# EAGLE schematic main (EAGLE 7.4.0)
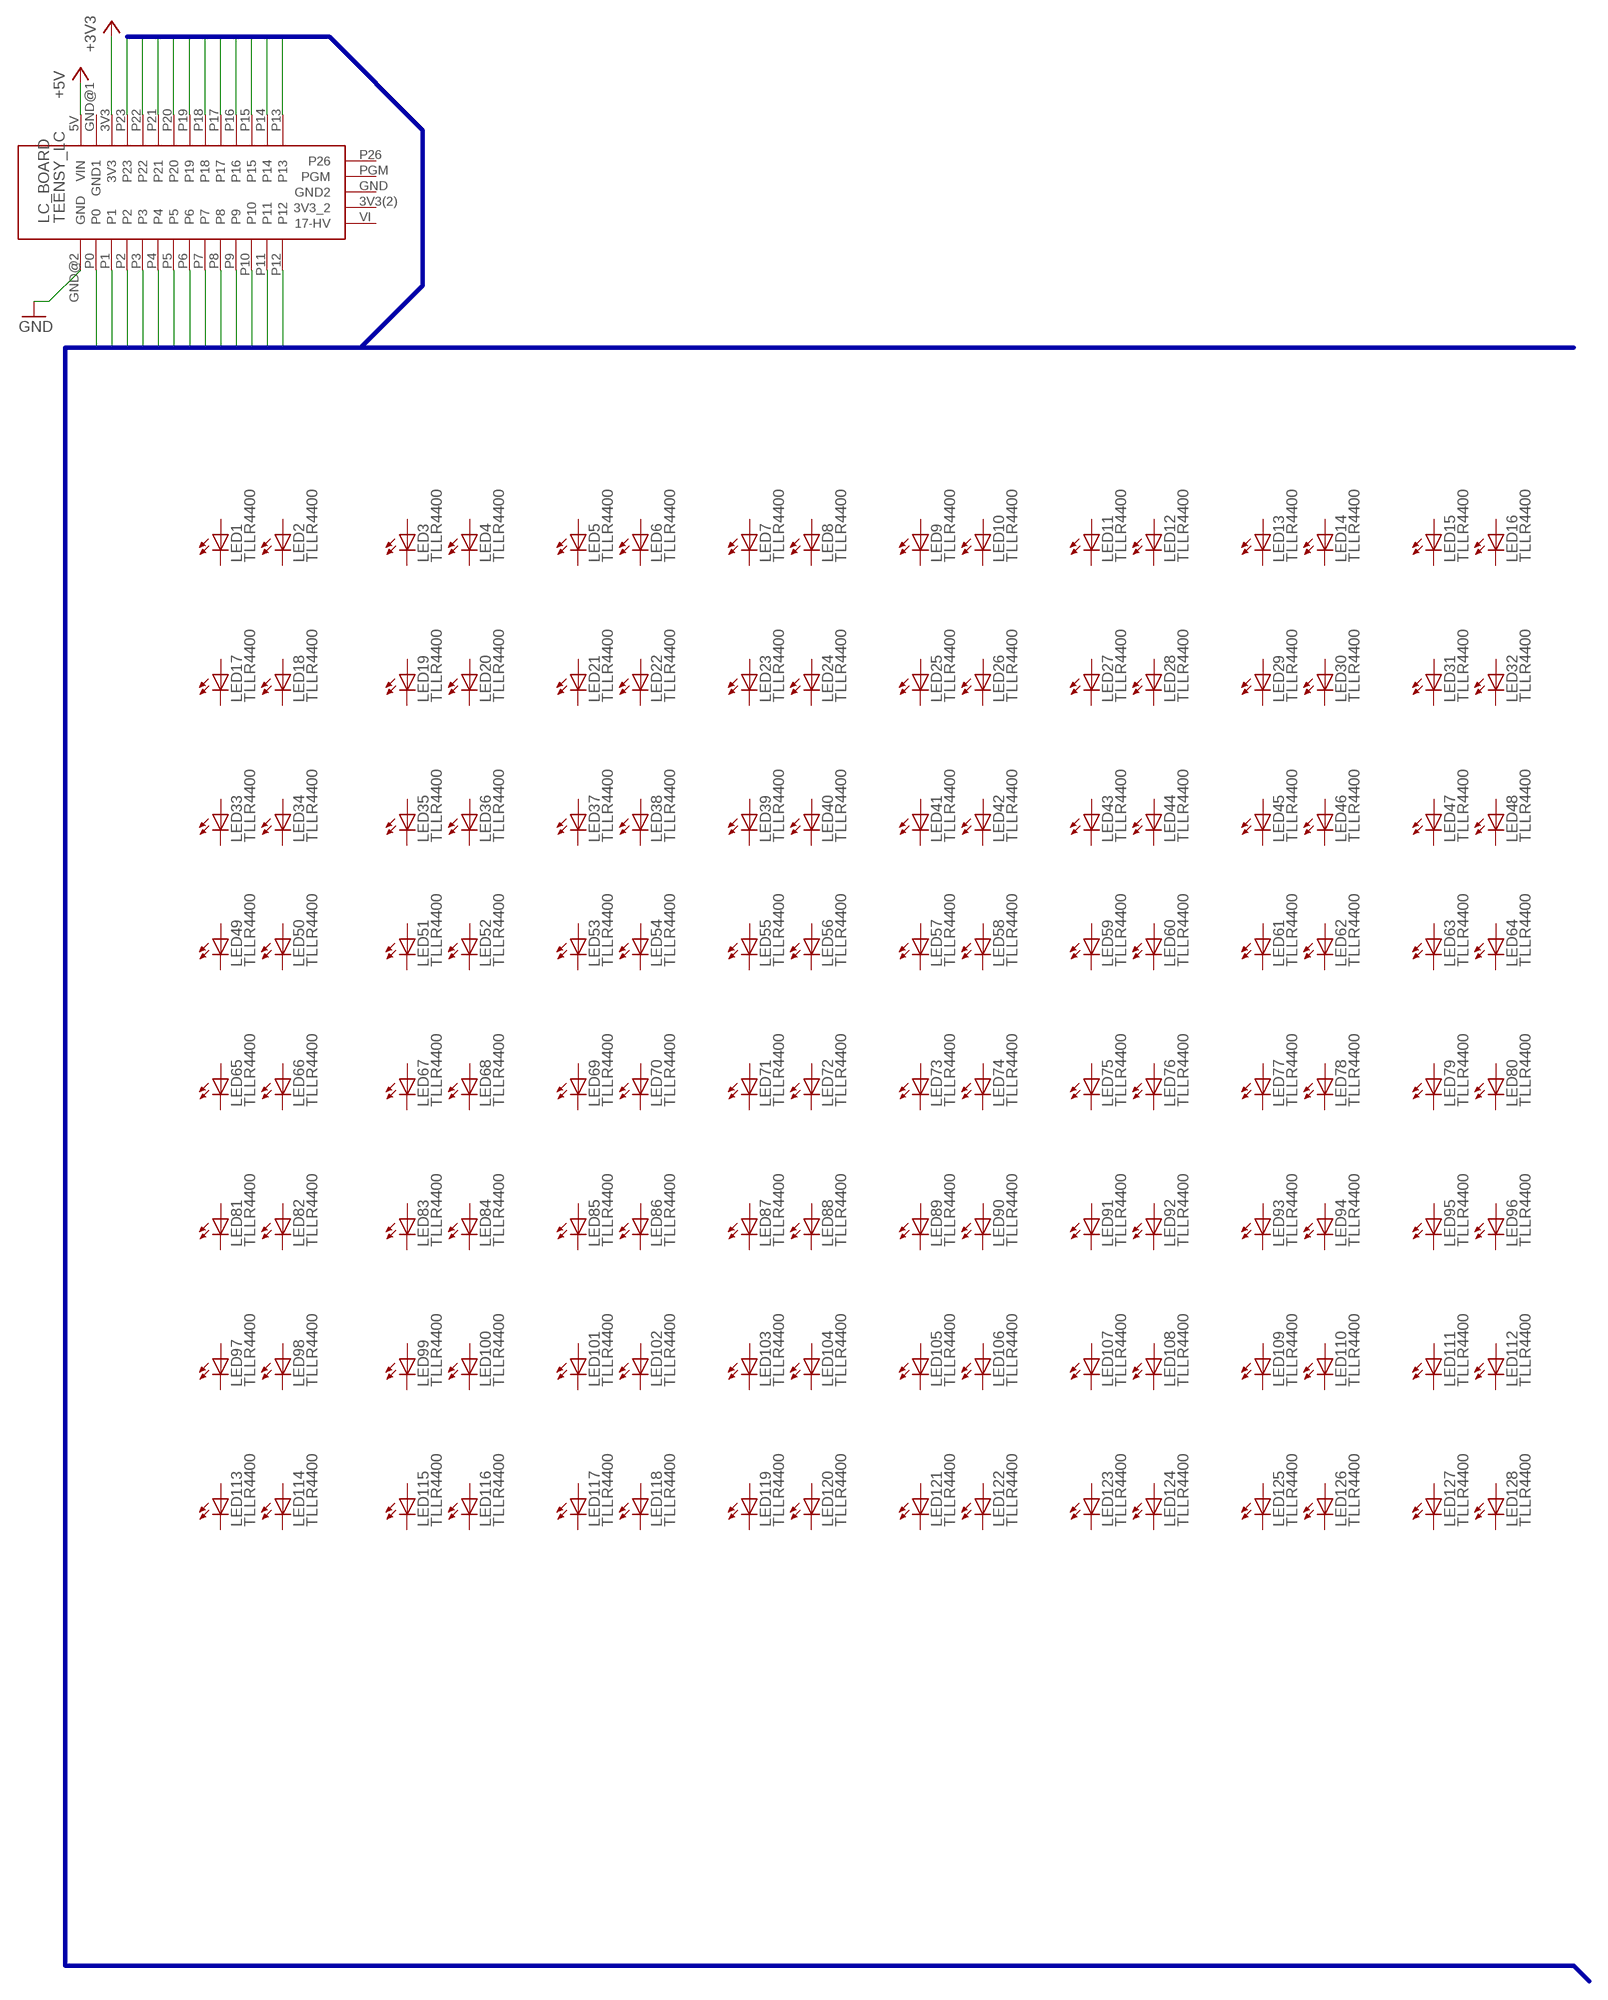
[diagram p0: schematic, sheet 1]

## Parts
LC_BOARD  TEENSY_LC  [TEENSYLC_PAC]
LED1  TLLR4400  [LED3MM]
LED2  TLLR4400  [LED3MM]
LED3  TLLR4400  [LED3MM]
LED4  TLLR4400  [LED3MM]
LED5  TLLR4400  [LED3MM]
LED6  TLLR4400  [LED3MM]
LED7  TLLR4400  [LED3MM]
LED8  TLLR4400  [LED3MM]
LED9  TLLR4400  [LED3MM]
LED10  TLLR4400  [LED3MM]
LED11  TLLR4400  [LED3MM]
LED12  TLLR4400  [LED3MM]
LED13  TLLR4400  [LED3MM]
LED14  TLLR4400  [LED3MM]
LED15  TLLR4400  [LED3MM]
LED16  TLLR4400  [LED3MM]
LED17  TLLR4400  [LED3MM]
LED18  TLLR4400  [LED3MM]
LED19  TLLR4400  [LED3MM]
LED20  TLLR4400  [LED3MM]
LED21  TLLR4400  [LED3MM]
LED22  TLLR4400  [LED3MM]
LED23  TLLR4400  [LED3MM]
LED24  TLLR4400  [LED3MM]
LED25  TLLR4400  [LED3MM]
LED26  TLLR4400  [LED3MM]
LED27  TLLR4400  [LED3MM]
LED28  TLLR4400  [LED3MM]
LED29  TLLR4400  [LED3MM]
LED30  TLLR4400  [LED3MM]
LED31  TLLR4400  [LED3MM]
LED32  TLLR4400  [LED3MM]
LED33  TLLR4400  [LED3MM]
LED34  TLLR4400  [LED3MM]
LED35  TLLR4400  [LED3MM]
LED36  TLLR4400  [LED3MM]
LED37  TLLR4400  [LED3MM]
LED38  TLLR4400  [LED3MM]
LED39  TLLR4400  [LED3MM]
LED40  TLLR4400  [LED3MM]
LED41  TLLR4400  [LED3MM]
LED42  TLLR4400  [LED3MM]
LED43  TLLR4400  [LED3MM]
LED44  TLLR4400  [LED3MM]
LED45  TLLR4400  [LED3MM]
LED46  TLLR4400  [LED3MM]
LED47  TLLR4400  [LED3MM]
LED48  TLLR4400  [LED3MM]
LED49  TLLR4400  [LED3MM]
LED50  TLLR4400  [LED3MM]
LED51  TLLR4400  [LED3MM]
LED52  TLLR4400  [LED3MM]
LED53  TLLR4400  [LED3MM]
LED54  TLLR4400  [LED3MM]
LED55  TLLR4400  [LED3MM]
LED56  TLLR4400  [LED3MM]
LED57  TLLR4400  [LED3MM]
LED58  TLLR4400  [LED3MM]
LED59  TLLR4400  [LED3MM]
LED60  TLLR4400  [LED3MM]
LED61  TLLR4400  [LED3MM]
LED62  TLLR4400  [LED3MM]
LED63  TLLR4400  [LED3MM]
LED64  TLLR4400  [LED3MM]
LED65  TLLR4400  [LED3MM]
LED66  TLLR4400  [LED3MM]
LED67  TLLR4400  [LED3MM]
LED68  TLLR4400  [LED3MM]
LED69  TLLR4400  [LED3MM]
LED70  TLLR4400  [LED3MM]
LED71  TLLR4400  [LED3MM]
LED72  TLLR4400  [LED3MM]
LED73  TLLR4400  [LED3MM]
LED74  TLLR4400  [LED3MM]
LED75  TLLR4400  [LED3MM]
LED76  TLLR4400  [LED3MM]
LED77  TLLR4400  [LED3MM]
LED78  TLLR4400  [LED3MM]
LED79  TLLR4400  [LED3MM]
LED80  TLLR4400  [LED3MM]
LED81  TLLR4400  [LED3MM]
LED82  TLLR4400  [LED3MM]
LED83  TLLR4400  [LED3MM]
LED84  TLLR4400  [LED3MM]
LED85  TLLR4400  [LED3MM]
LED86  TLLR4400  [LED3MM]
LED87  TLLR4400  [LED3MM]
LED88  TLLR4400  [LED3MM]
LED89  TLLR4400  [LED3MM]
LED90  TLLR4400  [LED3MM]
LED91  TLLR4400  [LED3MM]
LED92  TLLR4400  [LED3MM]
LED93  TLLR4400  [LED3MM]
LED94  TLLR4400  [LED3MM]
LED95  TLLR4400  [LED3MM]
LED96  TLLR4400  [LED3MM]
LED97  TLLR4400  [LED3MM]
LED98  TLLR4400  [LED3MM]
LED99  TLLR4400  [LED3MM]
LED100  TLLR4400  [LED3MM]
LED101  TLLR4400  [LED3MM]
LED102  TLLR4400  [LED3MM]
LED103  TLLR4400  [LED3MM]
LED104  TLLR4400  [LED3MM]
LED105  TLLR4400  [LED3MM]
LED106  TLLR4400  [LED3MM]
LED107  TLLR4400  [LED3MM]
LED108  TLLR4400  [LED3MM]
LED109  TLLR4400  [LED3MM]
LED110  TLLR4400  [LED3MM]
LED111  TLLR4400  [LED3MM]
LED112  TLLR4400  [LED3MM]
LED113  TLLR4400  [LED3MM]
LED114  TLLR4400  [LED3MM]
LED115  TLLR4400  [LED3MM]
LED116  TLLR4400  [LED3MM]
LED117  TLLR4400  [LED3MM]
LED118  TLLR4400  [LED3MM]
LED119  TLLR4400  [LED3MM]
LED120  TLLR4400  [LED3MM]
LED121  TLLR4400  [LED3MM]
LED122  TLLR4400  [LED3MM]
LED123  TLLR4400  [LED3MM]
LED124  TLLR4400  [LED3MM]
LED125  TLLR4400  [LED3MM]
LED126  TLLR4400  [LED3MM]
LED127  TLLR4400  [LED3MM]
LED128  TLLR4400  [LED3MM]

## Nets
+3V3: LC_BOARD.3V3
+5V: LC_BOARD.5V(VIN)
GND: LC_BOARD.GND@2(GND)
P0: LC_BOARD.P0
P1: LC_BOARD.P1
P2: LC_BOARD.P2
P3: LC_BOARD.P3
P4: LC_BOARD.P4
P5: LC_BOARD.P5
P6: LC_BOARD.P6
P7: LC_BOARD.P7
P8: LC_BOARD.P8
P9: LC_BOARD.P9
P10: LC_BOARD.P10
P11: LC_BOARD.P11
P12: LC_BOARD.P12
P13: LC_BOARD.P13
P14: LC_BOARD.P14
P15: LC_BOARD.P15
P16: LC_BOARD.P16
P17: LC_BOARD.P17
P18: LC_BOARD.P18
P19: LC_BOARD.P19
P20: LC_BOARD.P20
P21: LC_BOARD.P21
P22: LC_BOARD.P22
P23: LC_BOARD.P23
Unconnected: LC_BOARD.3V3(2)(3V3_2) LC_BOARD.GND(GND2) LC_BOARD.GND@1(GND1) LC_BOARD.P26 LC_BOARD.PGM LC_BOARD.VI(17-HV) LED1.A LED1.K(C) LED2.A LED2.K(C) LED3.A LED3.K(C) LED4.A LED4.K(C) LED5.A LED5.K(C) LED6.A LED6.K(C) LED7.A LED7.K(C) LED8.A LED8.K(C) LED9.A LED9.K(C) LED10.A LED10.K(C) LED11.A LED11.K(C) LED12.A LED12.K(C) LED13.A LED13.K(C) LED14.A LED14.K(C) LED15.A LED15.K(C) LED16.A LED16.K(C) LED17.A LED17.K(C) LED18.A LED18.K(C) LED19.A LED19.K(C) LED20.A LED20.K(C) LED21.A LED21.K(C) LED22.A LED22.K(C) LED23.A LED23.K(C) LED24.A LED24.K(C) LED25.A LED25.K(C) LED26.A LED26.K(C) LED27.A LED27.K(C) LED28.A LED28.K(C) LED29.A LED29.K(C) LED30.A LED30.K(C) LED31.A LED31.K(C) LED32.A LED32.K(C) LED33.A LED33.K(C) LED34.A LED34.K(C) LED35.A LED35.K(C) LED36.A LED36.K(C) LED37.A LED37.K(C) LED38.A LED38.K(C) LED39.A LED39.K(C) LED40.A LED40.K(C) LED41.A LED41.K(C) LED42.A LED42.K(C) LED43.A LED43.K(C) LED44.A LED44.K(C) LED45.A LED45.K(C) LED46.A LED46.K(C) LED47.A LED47.K(C) LED48.A LED48.K(C) LED49.A LED49.K(C) LED50.A LED50.K(C) LED51.A LED51.K(C) LED52.A LED52.K(C) LED53.A LED53.K(C) LED54.A LED54.K(C) LED55.A LED55.K(C) LED56.A LED56.K(C) LED57.A LED57.K(C) LED58.A LED58.K(C) LED59.A LED59.K(C) LED60.A LED60.K(C) LED61.A LED61.K(C) LED62.A LED62.K(C) LED63.A LED63.K(C) LED64.A LED64.K(C) LED65.A LED65.K(C) LED66.A LED66.K(C) LED67.A LED67.K(C) LED68.A LED68.K(C) LED69.A LED69.K(C) LED70.A LED70.K(C) LED71.A LED71.K(C) LED72.A LED72.K(C) LED73.A LED73.K(C) LED74.A LED74.K(C) LED75.A LED75.K(C) LED76.A LED76.K(C) LED77.A LED77.K(C) LED78.A LED78.K(C) LED79.A LED79.K(C) LED80.A LED80.K(C) LED81.A LED81.K(C) LED82.A LED82.K(C) LED83.A LED83.K(C) LED84.A LED84.K(C) LED85.A LED85.K(C) LED86.A LED86.K(C) LED87.A LED87.K(C) LED88.A LED88.K(C) LED89.A LED89.K(C) LED90.A LED90.K(C) LED91.A LED91.K(C) LED92.A LED92.K(C) LED93.A LED93.K(C) LED94.A LED94.K(C) LED95.A LED95.K(C) LED96.A LED96.K(C) LED97.A LED97.K(C) LED98.A LED98.K(C) LED99.A LED99.K(C) LED100.A LED100.K(C) LED101.A LED101.K(C) LED102.A LED102.K(C) LED103.A LED103.K(C) LED104.A LED104.K(C) LED105.A LED105.K(C) LED106.A LED106.K(C) LED107.A LED107.K(C) LED108.A LED108.K(C) LED109.A LED109.K(C) LED110.A LED110.K(C) LED111.A LED111.K(C) LED112.A LED112.K(C) LED113.A LED113.K(C) LED114.A LED114.K(C) LED115.A LED115.K(C) LED116.A LED116.K(C) LED117.A LED117.K(C) LED118.A LED118.K(C) LED119.A LED119.K(C) LED120.A LED120.K(C) LED121.A LED121.K(C) LED122.A LED122.K(C) LED123.A LED123.K(C) LED124.A LED124.K(C) LED125.A LED125.K(C) LED126.A LED126.K(C) LED127.A LED127.K(C) LED128.A LED128.K(C)

## Buses
P[0..23]

## Library data of the parts
LC_BOARD = affencustomlib:TEENSY_LC
LED1-LED128 = led:TLLR4400: Low Current (2mA) LED 3 mm Tinted Diffused Package color RED Source: Data sheet <http://www.farnell.com/datasheets/391100.pdf>; MF: VISHAY SEMICONDUCTOR; OC_FARNELL: 1612437